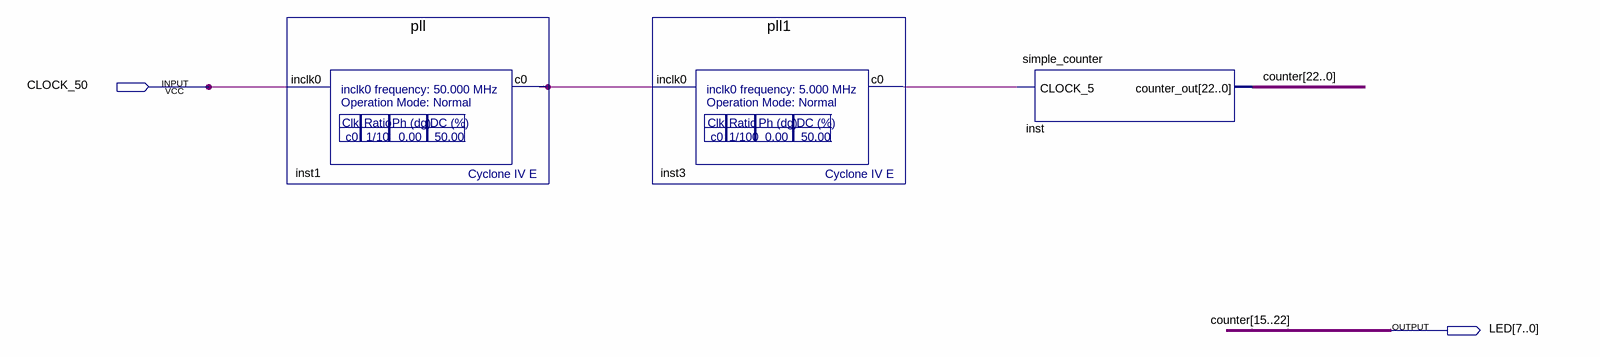
[diagram p0: schematic sheet]
// Quartus schematic firstproject.bdf as structural Verilog: 3 symbols, 2 pins
module firstproject (
  input  CLOCK_50,
  output [7:0] LED
);

  wire inst1_c0, inst3_c0;
  wire [14:0] counter;

  pll inst1 (.inclk0(CLOCK_50), .c0(inst1_c0));
  pll1 inst3 (.inclk0(inst1_c0), .c0(inst3_c0));
  simple_counter inst (
    .CLOCK_5(inst3_c0),
    .counter_out({LED[0], LED[1], LED[2], LED[3], LED[4], LED[5], LED[6], LED[7], counter}));

  // Other names for the same wires on the sheet: counter[22:15] = {LED[0], LED[1], LED[2], LED[3], LED[4], LED[5], LED[6], LED[7]}
endmodule
